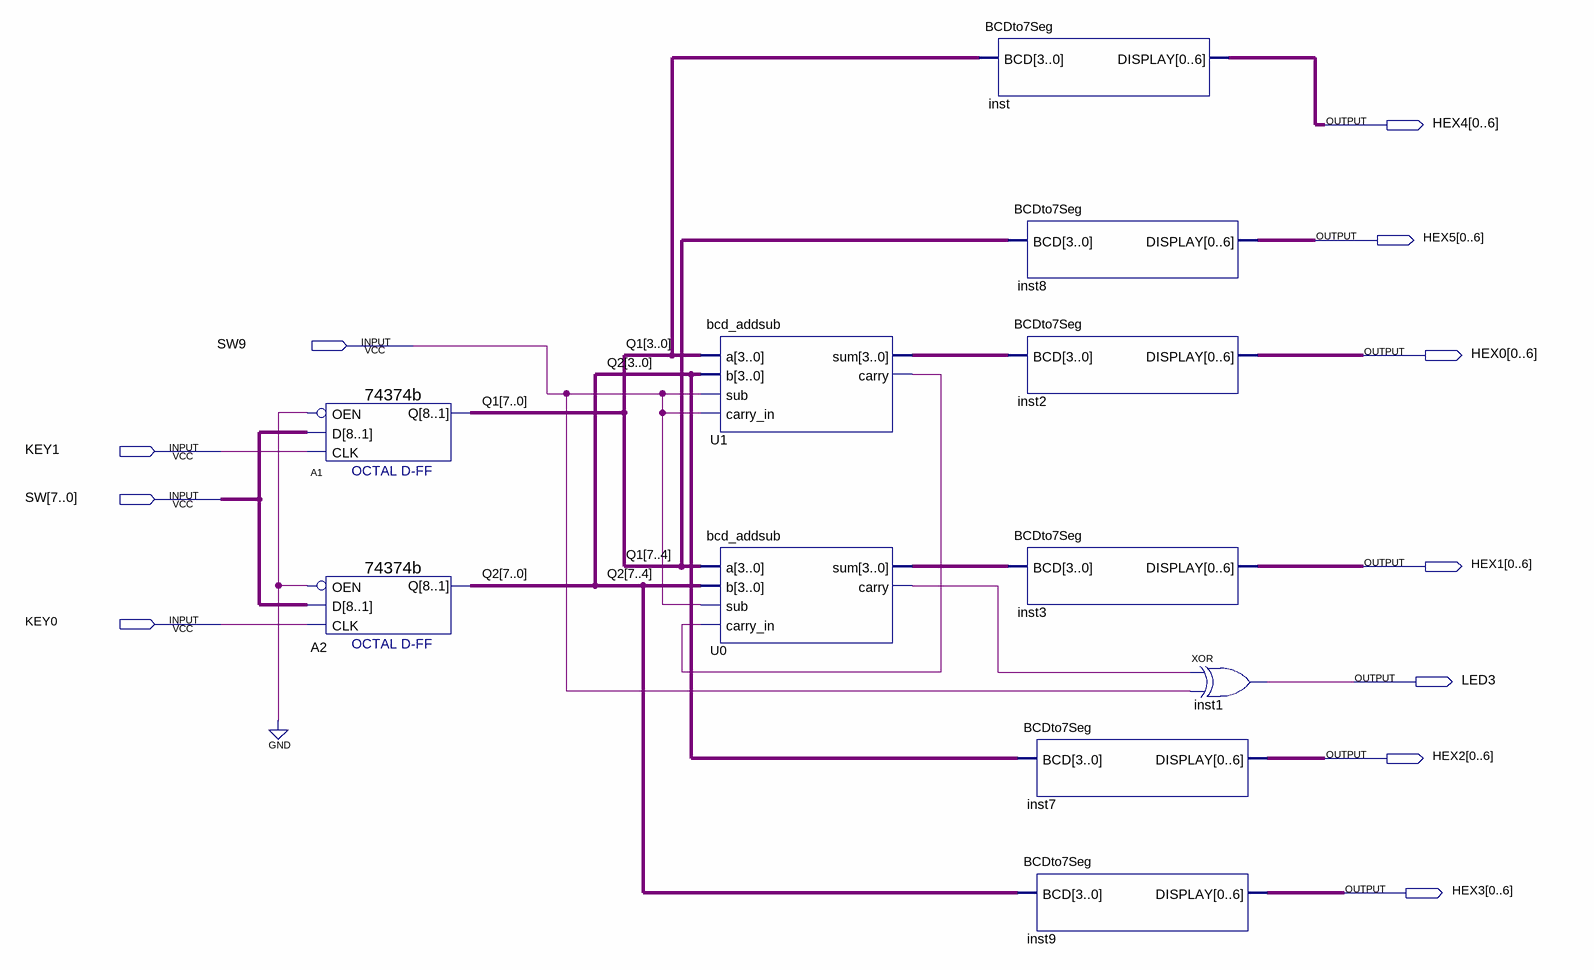
[diagram p0: schematic sheet]
// Quartus schematic add_sub_display.bdf as structural Verilog: 11 symbols, 11 pins
module add_sub_display (
  input  SW9,
  input  KEY1,
  input  [7:0] SW,
  input  KEY0,
  output [0:6] HEX4,
  output [0:6] HEX5,
  output [0:6] HEX0,
  output [0:6] HEX1,
  output LED3,
  output [0:6] HEX2,
  output [0:6] HEX3
);

  wire U0_carry, U1_carry;
  wire [3:0] U0_sum, U1_sum;
  wire [7:0] Q1, Q2;

  \74374b  A1 (.D(SW), .OEN(1'b0), .CLK(KEY1), .Q(Q1));
  \74374b  A2 (.D(SW), .OEN(1'b0), .CLK(KEY0), .Q(Q2));
  bcd_addsub U1 (.a(Q1[3:0]), .b(Q2[3:0]), .sub(SW9), .carry_in(SW9), .sum(U1_sum), .carry(U1_carry));
  bcd_addsub U0 (.a(Q1[7:4]), .b(Q2[7:4]), .sub(SW9), .carry_in(U1_carry), .sum(U0_sum), .carry(U0_carry));
  BCDto7Seg inst (.BCD(Q1[3:0]), .DISPLAY(HEX4));
  BCDto7Seg inst8 (.BCD(Q1[7:4]), .DISPLAY(HEX5));
  BCDto7Seg inst2 (.BCD(U1_sum), .DISPLAY(HEX0));
  BCDto7Seg inst3 (.BCD(U0_sum), .DISPLAY(HEX1));
  BCDto7Seg inst7 (.BCD(Q2[3:0]), .DISPLAY(HEX2));
  BCDto7Seg inst9 (.BCD(Q2[7:4]), .DISPLAY(HEX3));
  xor inst1 (LED3, U0_carry, SW9);
endmodule
